# EAGLE design untitled (EAGLE 5.07)
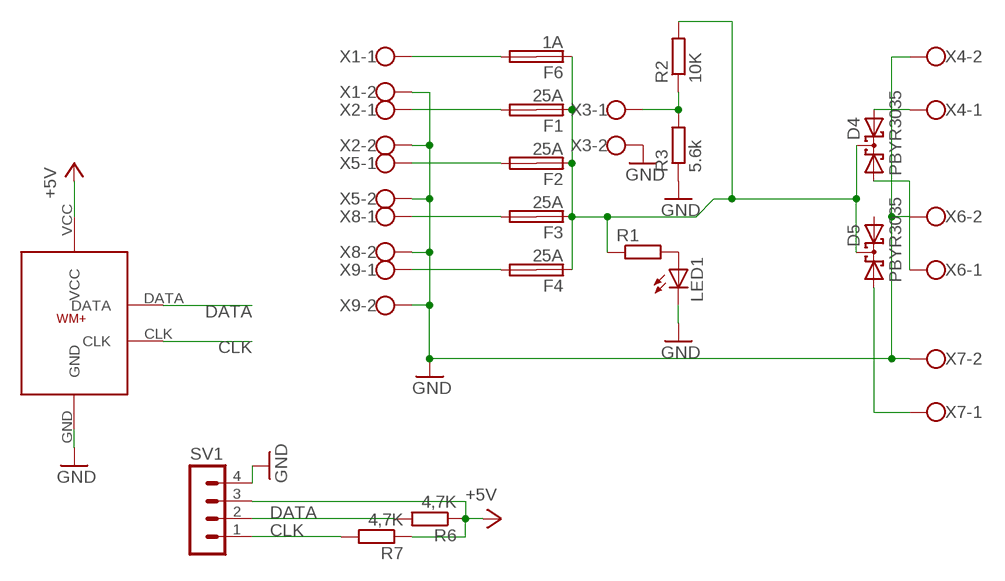
[diagram p0: schematic, sheet 1]

## Parts
D4  PBYR3035  [SOT93S]
D5  PBYR3035  [SOT93S]
F1  25A  SHK20L  [SHK20L]
F2  25A  SHK20L  [SHK20L]
F3  25A  SHK20L  [SHK20L]
F4  25A  SHK20L  [SHK20L]
F6  1A  SHK20L  [SHK20L]
LED1  LED10MM  [LED10MM]
R1  R-EU_0309/12  [0309/12]
R2  10K  R-EU_0309/12  [0309/12]
R3  5.6k  R-EU_0309/12  [0309/12]
R6  4,7K  R-EU_0207/10  [0207/10]
R7  4,7K  R-EU_0207/10  [0207/10]
SV1  MA04-1  [MA04-1]
U$1  WM+  [WM+]
X1  W237-02P  [W237-132]
X2  W237-02P  [W237-132]
X3  W237-02P  [W237-132]
X4  W237-02P  [W237-132]
X5  W237-02P  [W237-132]
X6  W237-02P  [W237-132]
X7  W237-02P  [W237-132]
X8  W237-02P  [W237-132]
X9  W237-02P  [W237-132]

## Nets
+5V: R6.1 R7.1 SV1.3 U$1.VCC
CLK: R7.2 SV1.1 U$1.CLK
DATA: R6.2 SV1.2 U$1.DATA
GND: LED1.K(C) R3.1 SV1.4 U$1.GND X1.2 X2.2 X3.2 X4.2 X5.2 X6.2 X7.2 X8.2 X9.2
N$1: F1.2A X2.1
N$2: F2.2A X5.1
N$3: F3.2A X8.1
N$4: F4.2A X9.1
N$5: D4.A2 X4.1
N$6: D4.A1 X6.1
N$7: D5.A1 X7.1
N$8: F6.2A X1.1
N$9: D4.C D5.C F1.1A F2.1A F3.1A F4.1A F6.1A R1.1 R2.2
N$11: LED1.A R1.2
N$12: R2.1 R3.2 X3.1
Unconnected: D5.A2 F1.1B F1.2B F2.1B F2.2B F3.1B F3.2B F4.1B F4.2B F6.1B F6.2B

## Library data of the parts
D4 D5 = diode:PBYR3035: Dual DIODE common cathode
F1-F4 F6 = fuse:SHK20L: FUSE HOLDER 5 x 20 mm, SH contact, SHH1 Schukat, E1073 Buerklin
LED1 = led:LED: LED OSRAM: - CHIPLED LG R971, LG N971, LY N971, LG Q971, LY Q971, LO R971, LY R971 LH N974, LH R974 LS Q976, LO Q976, LY Q976 LO Q996 - Hyper CHIPLED LW Q18S LB Q993, LB Q99A, LB R99A - SideLED LS A670, LO A670, LY A670, LG A670, LP A670 LB A673, LV A673, LT A673, LW A673 LH A674 LY A675 LS A676, LA A676, LO A676, LY A676, LW A676 LS A679, LY A679, LG A679 - Hyper Micro SIDELED® LS Y876, LA Y876, LO Y876, LY Y876 LT Y87S - SmartLED LW L88C, LW L88S LB L89C, LB L89S, LG L890 LS L89K, LO L89K, LY L89K LS L896, LA L896, LO L896, LY L896 - TOPLED LS T670, LO T670, LY T670, LG T670, LP T670 LSG T670, LSP T670, LSY T670, LOP T670, LYG T670 LG T671, LOG T671, LSG T671 LB T673, LV T673, LT T673, LW T673 LH T674 LS T676, LA T676, LO T676, LY T676, LB T676, LH T676, LSB T676, LW T676 LB T67C, LV T67C, LT T67C, LS T67K, LO T67K, LY T67K, LW E67C LS E67B, LA E67B, LO E67B, LY E67B, LB E67C, LV E67C, LT E67C LW T67C LS T679, LY T679, LG T679 LS T770, LO T770, LY T770, LG T770, LP T770 LB T773, LV T773, LT T773, LW T773 LH T774 LS E675, LA E675, LY E675, LS T675 LS T776, LA T776, LO T776, LY T776, LB T776 LHGB T686 LT T68C, LB T68C - Hyper Mini TOPLED® LB M676 - Mini TOPLED Santana® LG M470 LS M47K, LO M47K, LY M47K Source: http://www.osram.convergy.de LUXEON: - LUMILED® LXK2-PW12-R00, LXK2-PW12-S00, LXK2-PW14-U00, LXK2-PW14-V00 LXK2-PM12-R00, LXK2-PM12-S00, LXK2-PM14-U00 LXK2-PE12-Q00, LXK2-PE12-R00, LXK2-PE12-S00, LXK2-PE14-T00, LXK2-PE14-U00 LXK2-PB12-K00, LXK2-PB12-L00, LXK2-PB12-M00, LXK2-PB14-N00, LXK2-PB14-P00, LXK2-PB14-Q00 LXK2-PR12-L00, LXK2-PR12-M00, LXK2-PR14-Q00, LXK2-PR14-R00 LXK2-PD12-Q00, LXK2-PD12-R00, LXK2-PD12-S00 LXK2-PH12-R00, LXK2-PH12-S00 LXK2-PL12-P00, LXK2-PL12-Q00, LXK2-PL12-R00 Source: www.luxeon.com KINGBRIGHT: KA-3528ASYC Source: www.kingbright.com
R1-R3 R6 R7 = rcl:R-EU_: RESISTOR, European symbol
SV1 = con-lstb:MA04-1: PIN HEADER
U$1 = wmplus:WM+
X1-X9 = con-wago-508:W237-02P: WAGO SREW CLAMP

## Board
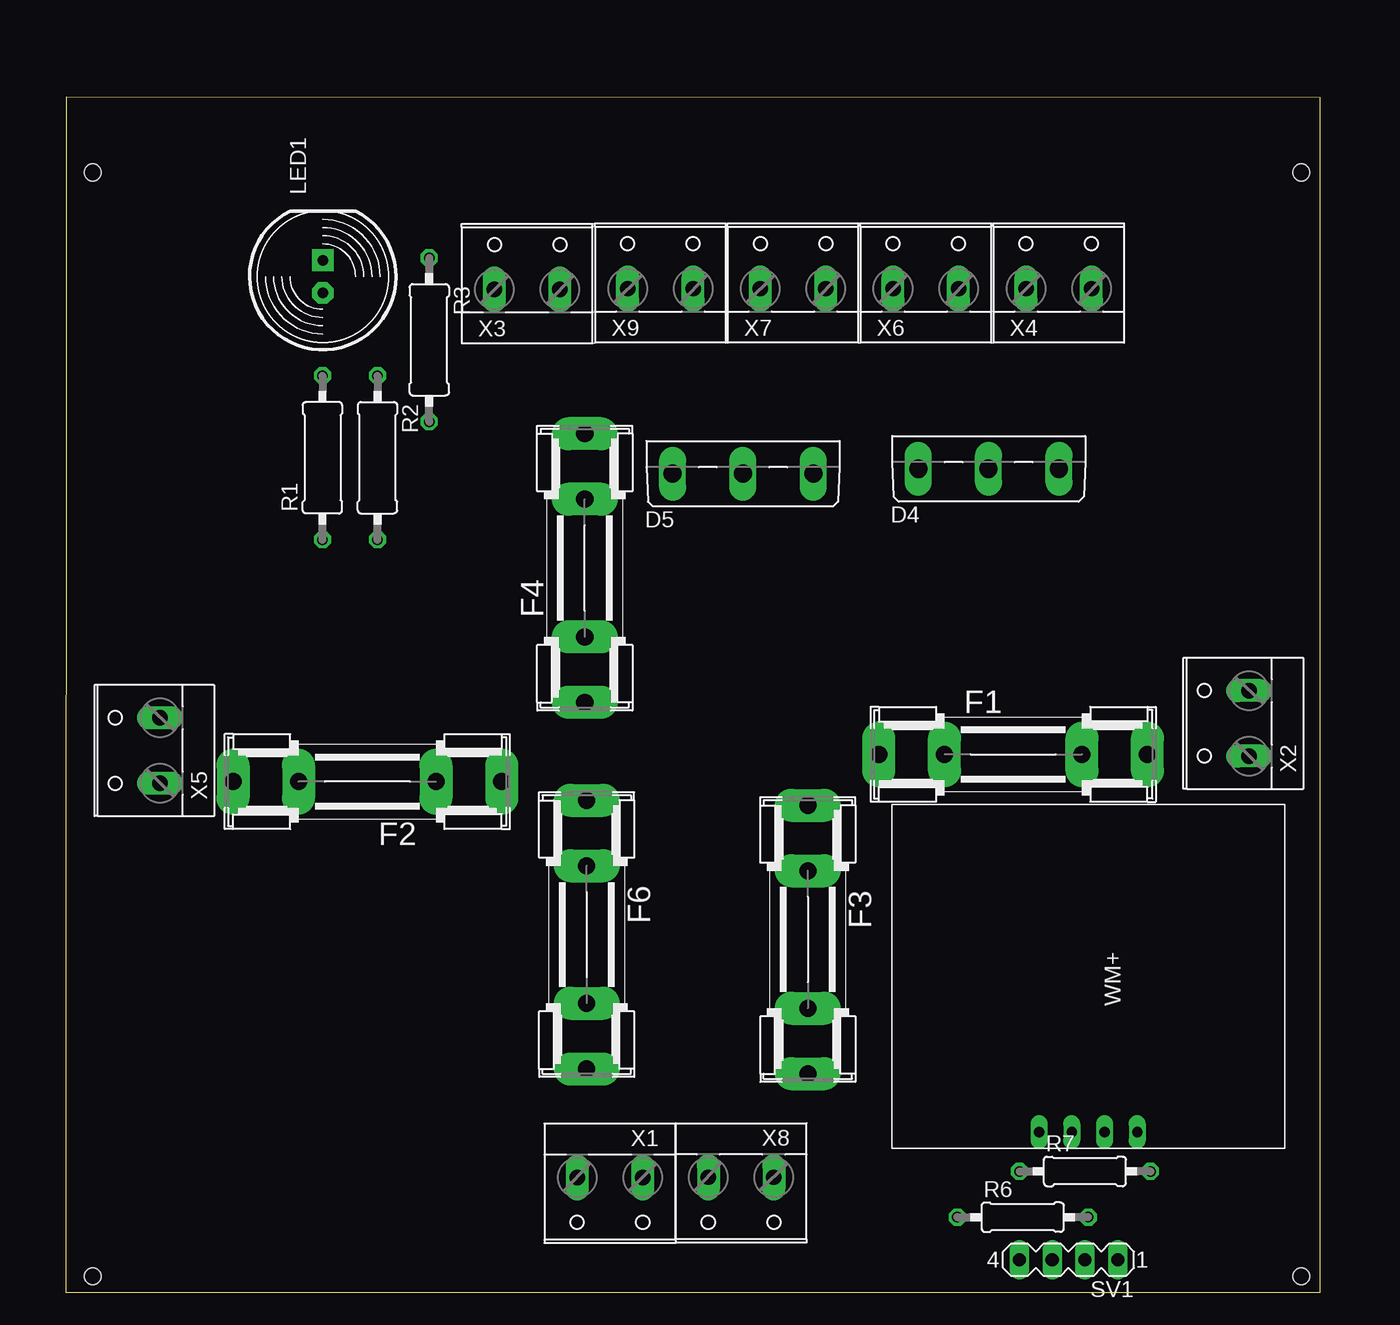
[diagram p1: board, top side]
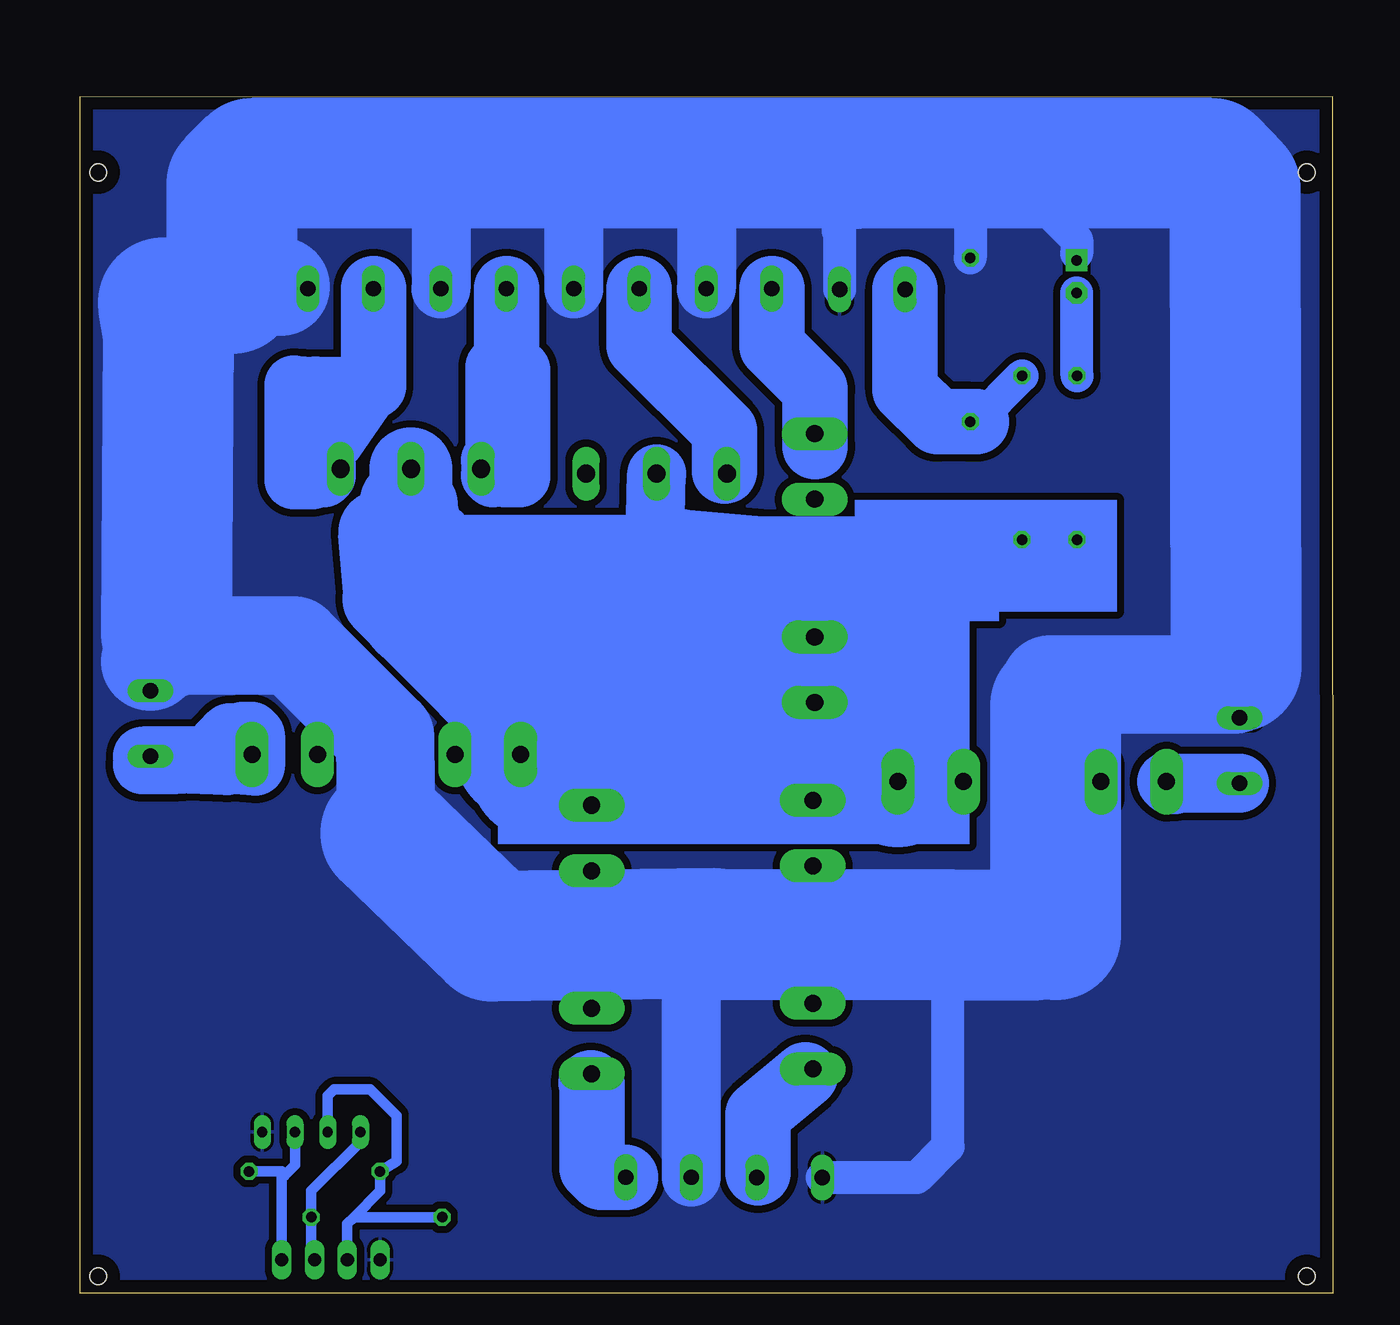
[diagram p2: board, bottom side, seen from below]

Size 97.21 x 92.75 mm. Coordinates in mm from the lower left corner, seen from the top.
Outline: 0.03,92.75 97.21,92.72 97.21,0 0,0.01 0.03,92.75
Copper layers (1*16): Top 0.035mm / dielectric 1.5mm / Bottom 0.035mm
Design rules "default *": minimum track width 254mil, minimum drill 24mil, track to track 22mil, track to pad 22mil, pad to pad 8mil, via to via 8mil, smd to smd 8mil, copper to edge 40mil, drill to drill 8mil, minimum pad ring 10mil, minimum via ring 8mil, stop-mask expansion 4mil, vias tented up to drill 0mil, thermal gap 10mil
Holes 1.3 mm at 2.03,86.88 2.03,1.28 95.76,86.88 95.76,1.28

### Footprints (pad centres in the part's own frame; a part is rotated, then mirrored left to right if it is on the bottom)
SOT93S = drill 1.397 long: A1 -5.461,-2.54; A2 5.461,-2.54; C 0,-2.54
SHK20L = drill 1.321 pad 2.54 long: 1A -10.414,0; 1B -5.334,0; 2A 10.414,0; 2B 5.334,0
LED10MM = drill 0.813 pad 1.676 octagon: A -1.27,0 | drill 0.813 pad 1.676 square: K 1.27,0
0309/12 = drill 0.813 octagon: 1 -6.35,0; 2 6.35,0
0207/10 = drill 0.813 octagon: 1 -5.08,0; 2 5.08,0
MA04-1 = drill 1.016 long: 1 -3.81,0; 2 -1.27,0; 3 1.27,0; 4 3.81,0
WM+ = drill 0.8 long: CLK 12.7,1.27; DATA 12.7,-3.81; GND 12.7,3.81; VCC 12.7,-1.27
W237-132 = drill 1.194 long: 1 -2.54,-0.635; 2 2.54,-0.635

### Placement (x,y rotation side)
D4  71.53,66.43 0 top
D5  52.48,66.05 0 top
F1  73.43,41.74 0 top
F2  23.34,39.63 180 top
F3  57.51,27.39 270 top
F4  40.21,56.19 90 top
F6  40.36,27.77 270 top
LED1  19.89,78.8 90 top
R1  19.86,64.75 90 top
R2  24.13,64.75 270 top
R3  28.14,73.9 270 top
R6  74.17,5.85 0 top
R7  78.99,9.41 0 top
SV1  77.72,2.55 180 top
U$1  79.25,25.16 270 top
X1  42.16,8.29 180 top
X2  91.08,44.16 90 top
X3  35.74,78.45 0 top
X4  76.96,78.5 0 top
X5  6.63,42.05 90 top
X6  66.65,78.5 0 top
X7  56.36,78.5 0 top
X8  52.32,8.32 180 top
X9  46.08,78.5 0 top

### Tracks (layer width: path | path; a pad name or v marks a point on that pad's centre or on a via)
+5V
  Bottom 0.813: U$1.VCC 77.98,15.25 77.47,15.76 74.68,15.76 72.64,13.73 72.64,10.17 R7.1 73.91,7.88 75.95,5.85 | SV1.3 76.45,5.34 75.95,5.85 | R6.1 75.95,5.85
CLK
  Bottom 0.813: U$1.CLK 80.52,9.92 81.28,9.15 | 81.28,9.15 81.53,8.9 SV1.1 | R7.2 81.53,9.41 81.28,9.15
DATA
  Bottom 0.813: U$1.DATA 75.44,11.69 79.25,7.88 R6.2 79.25,2.8 SV1.2
GND
  Bottom 0.254: 36.07,84.72 36.78,84.72 37.01,84.49 37.69,84.49 37.77,84.41 38,84.41 38.25,84.67
  Bottom 0.61: 38.38,82.36 38.28,82.26 | 37.01,87.59 37.01,84.49 37.01,83.96 | 7.67,47.18 7.67,44.99 X5.2
  Bottom 0.813: 19.89,80.58 LED1.K | 24.03,84.72 28.19,84.72 36.07,84.72
  Bottom 1.27: X2.2 91.72,49.39 91.49,49.62
  Bottom 10.16: 90.47,51.14 90.32,74.31 90.73,76.77 | 47.93,27.85 65.2,27.65 73.46,35.62 | 23.27,27.75 29.36,27.75 48.82,27.75 | 21.51,27.77 21.51,45.5 | 7.52,48.52 7.6,85.66 9.45,87.59 37.01,87.59 48.82,87.59 59.28,87.59 69.57,87.59 83.82,87.59 85.42,85.99 85.42,77.89
  Bottom 2.54: X4.2 84.25,77.86 84.33,77.79 79.6,77.79 79.5,77.89 | R3.1 28.14,84.67 28.19,84.72 | 38.28,82.26 X3.2 | 38.38,82.36 38.38,84.54 38.25,84.67 | 19.89,80.58 19.89,81.65 22.91,84.67 23.98,84.67 24.03,84.72 | X1.2 32.28,8.92 29.87,11.34 29.87,27.24 29.36,27.75
  Bottom 4.572: X8.2 49.78,26.78 48.82,27.75 | X6.2 69.19,87.21 69.57,87.59 | X7.2 58.9,87.21 59.28,87.59 | X9.2 48.62,87.39 48.82,87.59 | 84.33,77.79 85.17,77.79 85.24,77.71
  Bottom 6.096: 48.9,27.75 47.93,27.85 | 89.53,50.2 90.47,51.14
  Bottom 7.62: 91.49,49.62 91.49,49.18 91.75,48.93 90.47,51.14 | 90.73,76.77 83.21,78.12 81.61,78.04 | 73.46,35.62 73.53,43.11 80.62,50.2 89.53,50.2 | 48.82,27.75 48.9,27.75 | 23.27,27.75 21.51,27.77 | 21.51,45.5 21.92,47.18 7.67,47.18 7.52,48.52 | 85.42,77.89 85.24,77.71
  pour Bottom: -0.51,92.72 98.55,92.72 97.28,0.01 -0.51,0.01
N$1
  Bottom 4.572: 92.33,41.61 X2.1 87.78,41.61 87.68,41.51 86.11,41.51 84.91,42.71 84.4,42.71 84.23,42.53 84.23,41.26 84.07,41.11 84.91,41.11 85.09,40.93 83.57,40.83 83.57,43.21 83.9,43.55 84.56,43.55 84.73,43.37 85.6,43.44 87.53,41.44 86.51,41.44 85.78,40.88 89.79,41.03 89.89,40.93 | 89.89,40.93 92.35,40.93 | 89.89,40.93 84.4,41.18 F1.2A
N$2
  Bottom 4.572: X5.1 12.22,39.51 12.32,39.41 12.7,39.41 F2.2A
N$3
  Bottom 0.254: 57.56,16.29 57.56,16.93 F3.2A
  Bottom 5.08: X8.1 56.77,8.95 57.48,9.66 57.48,16.21 57.56,16.29
N$4
  Bottom 4.572: 40.18,65.62 F4.2A
  Bottom 5.08: X9.1 43.54,73.42 40.18,70.06 40.18,65.62
N$5
  Bottom 0.406: D4.A2 78.05,63.89 78.08,63.87
  Bottom 4.572: 74.42,70.34 78.92,70.32 80.59,70.39 80.59,63.03 79.17,63.03 78.08,64.12 78.08,63.87 78.08,63.38 78.26,63.2 78.26,66.05 74.47,70.42 77.39,66.15 77.83,65.72
  Bottom 5.08: 74.42,70.34 X4.1
N$6
  Bottom 0.406: 64.49,63.69 64.72,63.69 64.87,63.84 | 65.35,63.38 65.56,63.38 D4.A1
  Bottom 4.572: 64.11,71.33 62.99,71.56 62.99,63.28 63.07,63.2 64.24,63.2 64.87,63.84 65,63.97 65,71.82 64.85,71.97 | 63.52,63.69 64.49,63.69 65.35,64.55 65.35,63.38 65.18,63.2
  Bottom 5.08: 64.11,71.33 X6.1
N$7
  Bottom 4.572: D5.A1 47.22,63.71
  Bottom 5.08: X7.1 53.82,73.44 47.22,66.84 47.22,63.71
N$8
  Bottom 2.54: 40.95,16.9 F6.2A | X1.1 44.6,9.28
  Bottom 5.08: 40.95,16.9 44.6,13.83 44.6,9.28
N$9
  Bottom 0.813: 33.76,41.21 33.76,44.23
  Bottom 1.676: 61.8,40.29 61.8,41.74 | F6.1A 40.21,39.38 40.21,41.06 | 33.76,41.21 39.52,41.21 39.52,41.89 49.71,41.89 F3.1A
  Bottom 10.16: F4.1A 40.11,54.9 40.39,41.56 49.66,41.56 49.15,41.06 61.8,40.29 | 40.21,41.06 33.76,41.21 F2.1A | 49.71,41.89 49.71,51.6 52.5,54.39 52.73,52.13 | 52.73,52.13 53.19,55.23 71.73,55.23 | F1.1A 61.8,41.74 61.75,41.74 55.47,48.02 63.25,48.02 64.34,49.11 64.34,49.69 67.72,53.07 69.9,53.07 70.08,53.25 70.51,53.25 70.59,53.32 70.05,53.32 69.72,52.99 69.72,52.92 69.47,52.66 69.47,52.56 69.32,52.41 68.56,52.77 68.45,52.66 69.16,52.16 68.81,51.8 68.53,51.8 67.79,51.06 67.79,50.99 67.61,50.81 67.56,50.81 67.46,50.71 67.46,50.56 67.28,50.38 67.28,50.28 66.95,49.95 66.78,49.95 66.52,49.69 66.42,49.69 65.76,49.03 65.76,48.93 65.68,48.85 65.68,48.7 47.73,48.7 44.6,45.58 44.53,45.58 43.84,44.89 43.84,44.97 43.08,45.73 43.41,45.73 43.59,45.91 43.59,46.24 43.76,46.42 43.84,46.42 44.09,46.67 44.09,46.75 44.78,47.43 45.11,47.43 45.62,47.94 45.62,48.09 46.38,48.85 46.38,48.93 46.63,49.18 46.63,49.39 48.31,51.06 48.31,51.11 48.41,51.22 48.56,51.22 50.16,52.82 50.16,52.89 51.18,53.91 51.18,54.01 51.51,54.34 39.83,54.77 51.26,55.79 51.82,55.28 52.73,52.13
  Bottom 11.43: 40.21,41.06 49.15,41.06
  Bottom 2.54: 26.44,58.41 R2.2
  Bottom 4.572: D5.C 52.73,52.13 52.48,54.92 53.19,55.23 | 71.73,55.23 71.53,54.42 | 71.53,58.05 71.32,58.25
  Bottom 5.08: R2.2 R1.1 | 26.44,58.41 33.07,53.81 33.07,43.39 33.76,44.23
  Bottom 6.452: D4.C 71.53,61.22 71.83,60.92 72.26,61.35 71.35,61.35 71.09,61.1 71.09,59.5 69.83,58.23 72.49,58.23 73.18,57.54 73.46,57.54 73.53,57.46 73.53,55.1 | 73.53,54.09 73.94,58.99 73.61,55.61 73.61,55.18 73.53,55.1 | 73.53,54.09 72.59,54.75 70.18,54.75 | 73.53,54.09 73.53,55.1 | 70.18,54.75 64.13,45.78 | 70.18,54.75 73.61,53.81 64.82,44.92 71.78,54.16 71.73,55.23
  Bottom 7.62: 71.53,54.42 71.53,58.05 71.53,59.8 71.5,59.83
N$11
  Bottom 2.54: LED1.A 19.89,71.84 R1.2
N$12
  Bottom 2.54: 27.69,67.55 R2.1
  Bottom 5.08: 27.69,67.55 R3.2 30.71,67.55 33.2,70.04 X3.1
(copper drawn outside any net)
  shapes: Bottom area x3